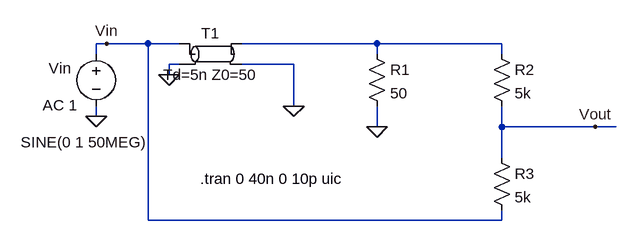
[diagram p0: schematic _Fig1_13_MSD.asc]
_Fig1_13_MSD.asc, the LTspice schematic file:
Version 4
SHEET 1 1056 688
WIRE 96 304 80 304
WIRE 160 304 96 304
WIRE 208 304 160 304
WIRE 512 304 304 304
WIRE 704 304 512 304
WIRE 80 320 80 304
WIRE 512 320 512 304
WIRE 704 320 704 304
WIRE 208 336 192 336
WIRE 384 336 304 336
WIRE 192 352 192 336
WIRE 384 400 384 336
WIRE 80 416 80 400
WIRE 512 432 512 400
WIRE 704 432 704 400
WIRE 848 432 704 432
WIRE 880 432 848 432
WIRE 704 480 704 432
WIRE 160 576 160 304
WIRE 704 576 704 560
WIRE 704 576 160 576
FLAG 512 432 0
FLAG 384 400 0
FLAG 192 352 0
FLAG 80 416 0
FLAG 96 304 Vin
FLAG 848 432 Vout
SYMBOL tline 256 320 R0
SYMATTR InstName T1
SYMATTR Value Td=5n Z0=50
SYMBOL res 496 304 R0
SYMATTR InstName R1
SYMATTR Value 50
SYMBOL res 688 304 R0
SYMATTR InstName R2
SYMATTR Value 5k
SYMBOL res 688 464 R0
SYMATTR InstName R3
SYMATTR Value 5k
SYMBOL voltage 80 304 R0
WINDOW 0 -73 38 Left 0
WINDOW 123 -82 95 Left 0
WINDOW 39 0 0 Left 0
WINDOW 3 -116 152 Left 0
SYMATTR InstName Vin
SYMATTR Value2 AC 1
SYMATTR Value SINE(0 1 50MEG)
TEXT 240 512 Left 0 !.tran 0 40n 0 10p uic

The netlist it stands for:
* _Fig1_13_MSD.asc
T1 Vin 0 N001 0 Td=5n Z0=50
R1 N001 0 50
R2 N001 Vout 5k
R3 Vout Vin 5k
Vin Vin 0 SINE(0 1 50MEG) AC 1
.tran 0 40n 0 10p uic
.backanno
.end